# Altium schematic sheet Root.SchDoc
size A; SheetNumber: 3; SheetTotal: 11
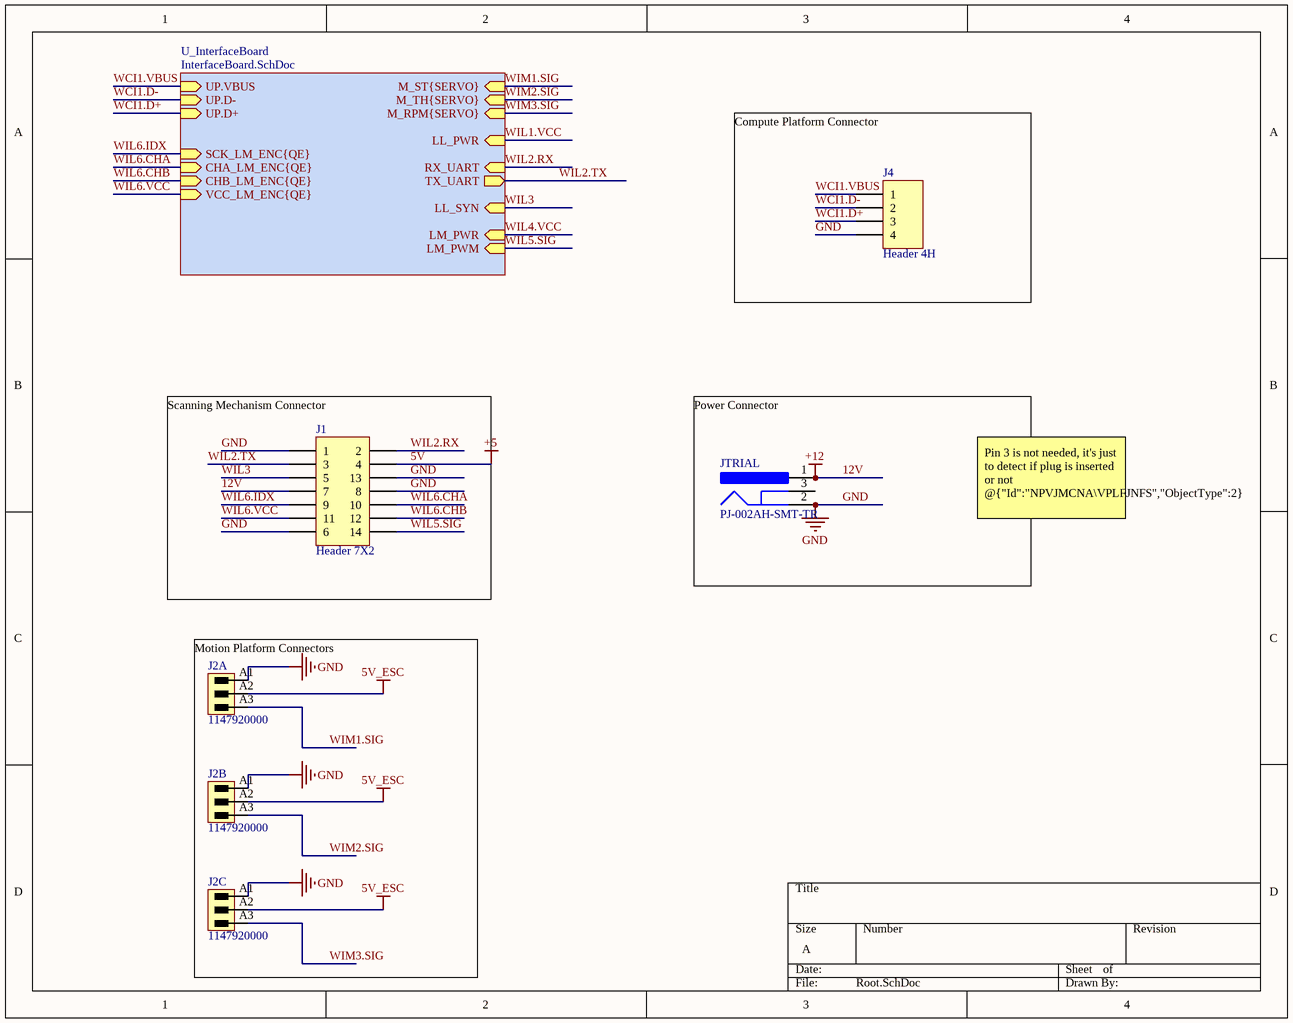
[diagram p0: Root.SchDoc]

## Parts
J1  Header 7X2  [HDR2X7]
J2A  1147920000  [SL_5_08HC_180LF_03]
J2B  1147920000  [SL_5_08HC_180LF_03]
J2C  1147920000  [SL_5_08HC_180LF_03]
J4  Header 4H  [HDR1X4H]
JTRIAL  PJ-002AH-SMT-TR  [CUI-PJ-002AH-4_V]

## Sub-sheets
U_InterfaceBoard = InterfaceBoard.SchDoc: M_RPM{SERVO} (in), M_ST{SERVO} (in), M_TH{SERVO} (in), SCK_LM_ENC{QE} (in), CHB_LM_ENC{QE} (in), CHA_LM_ENC{QE} (in), VCC_LM_ENC{QE} (in), LM_PWM (in), RX_UART (in), TX_UART (out), LL_SYN (in), LL_PWR (in), LM_PWR (in), UP.VBUS (in), UP.D+ (in), UP.D- (in)

## Nets
5V: J1.4  [also labelled +5]
5V_ESC: J2A.A2 J2B.A2 J2C.A2
12V: J1.7 JTRIAL.1  [also labelled +12]
GND: J1.1 J1.6 J1.8 J1.13 J2A.A1 J2B.A1 J2C.A1 J4.4 JTRIAL.2
WCI1.D+: J4.3 ; sheet U_InterfaceBoard/UP.D+
WCI1.D-: J4.2 ; sheet U_InterfaceBoard/UP.D-
WCI1.VBUS: J4.1 ; sheet U_InterfaceBoard/UP.VBUS
WIL1.VCC: sheet U_InterfaceBoard/LL_PWR
WIL2.RX: J1.2 ; sheet U_InterfaceBoard/RX_UART
WIL2.TX: J1.3 ; sheet U_InterfaceBoard/TX_UART
WIL3: J1.5 ; sheet U_InterfaceBoard/LL_SYN
WIL4.VCC: sheet U_InterfaceBoard/LM_PWR
WIL5.SIG: J1.14 ; sheet U_InterfaceBoard/LM_PWM
WIL6.CHA: J1.10 ; sheet U_InterfaceBoard/CHA_LM_ENC{QE}
WIL6.CHB: J1.12 ; sheet U_InterfaceBoard/CHB_LM_ENC{QE}
WIL6.IDX: J1.9 ; sheet U_InterfaceBoard/SCK_LM_ENC{QE}
WIL6.VCC: J1.11 ; sheet U_InterfaceBoard/VCC_LM_ENC{QE}
WIM1.SIG: J2A.A3 ; sheet U_InterfaceBoard/M_ST{SERVO}
WIM2.SIG: J2B.A3 ; sheet U_InterfaceBoard/M_TH{SERVO}
WIM3.SIG: J2C.A3 ; sheet U_InterfaceBoard/M_RPM{SERVO}

Not connected (* = marked no-connect by the designer): JTRIAL 3

## Notes on the sheet
- (near J4) Compute Platform Connector
- Pin numbering on footprint does not match old design. To minimize confusion we probably should change this at some point @{"Id":"NPVJMCNA\MLTVRLOO","ObjectType":2}
- Pin 3 is not needed, it's just to detect if plug is inserted or not @{"Id":"NPVJMCNA\VPLFJNFS","ObjectType":2}
- (near J1) Scanning Mechanism Connector
- (near JTRIAL) Power Connector
- Motion Platform Connectors

## Library data of the parts
J1 = CMP-002-00362-2: Header, 7-Pin, Dual row; Signal Integrity: Connector; Publisher: Altium Limited; LatestRevisionDate: 17-Jul-2002; LatestRevisionNote: Re-released for DXP Platform.; Component Type: Standard; Source: Miscellaneous Connectors.SchLib; Pins: 14; Design Item ID: Header 7X2
J2A J2B J2C = CMP-1559-01007-1: OMNIMATE Signal - series BL/SL 5.08; Manufacturer: Weidmueller; Contact_surface: tinned; Outgoing_elbow: 180°; Rated_voltage_use_group_B_UL_1059: 300 V; Insulating_material: PA GF; Solder_pin_length_mm: 3.2 mm; Rated_voltage_for_surge_voltage_class_pollution_degree_II_2: 400 V; Side_termination_characteristic: Solder flange; Pitch_mm: 5.08 mm; No_of_poles: 3; Rated_current_use_group_B_UL_1059: 16 A; Short_text_for_material: SL 5.08HC/03/180LF 3.2SN OR BX; Pitch_inch: 0.2 inch; Contact_material: Cu-Leg; UL_94_flammability_rating: V-0; Mounting_onto_the_PCB: Solder connection; Packaging: Box; ComponentLink1URL: http://www.weidmueller.com/; Colour: Orange; PackageReference: SL_5_08HC_180LF_03; Qty: 100 PCS; ComponentLink1Description: Manufacturer URL; Revision: V1; ComponentLink2Description: URL Link1; ComponentLink2URL: http://catalog.weidmueller.com/catalog/Start.do?localeId=en&ObjectID=1147920000; PartNumber: 1147920000
J4 = Header 4H: Header, 4-Pin, Right Angle; LatestRevisionDate: 17-Jul-2002; LatestRevisionNote: Re-released for DXP Platform.; Publisher: Altium Limited
JTRIAL = CMP-2000-06896-2: DC Power Jack, Right Angle, -25 to 85 degC, 4-Pin 14.8 x 9 x 11 mm SMD, RoHS, Tape and Reel; Manufacturer: CUIInc.; Brand: CUI; Inside Contact Diameter: 2mm; Voltage Rating: 24V; Insulation Resistance: 100MOhms; Outside Contact Diameter: 6.5mm; Current Rating: 5A; Mounting Angle: Right; Contact Plating: Nickel; Package Description: 4-Pin Surface Mount Device, Body 14.8 x 9 mm, Pitch 6.1 mm; Factory Pack Quantity: 350; Datasheet Version: Rev. 1.03, 11/2012; Operating Temperature Range: -25Cto+85C; Termination Style: SMD/SMT; Product: Jacks; Contact Gender: Male; Product Category: DCPowerConnectors; RoHS: True; Connector Type: DCPowerJack; Packaging: Reel; Contact Material: Brass; Flammability Rating: UL94V-0; Datasheet URL: http://www.cui.com/product/resource/pj-002ah-smt.pdf; Package Reference: PJ-002AH; Manufacturer URL: http://www.cui.com/; PartNumber: PJ-002AH; Mounting Style: SMD/SMT; Mounting Technology: SurfaceMount; Housing Material: Polyamide(PA)